# EAGLE design ESP01M_Carrier (EAGLE 9.0.1)
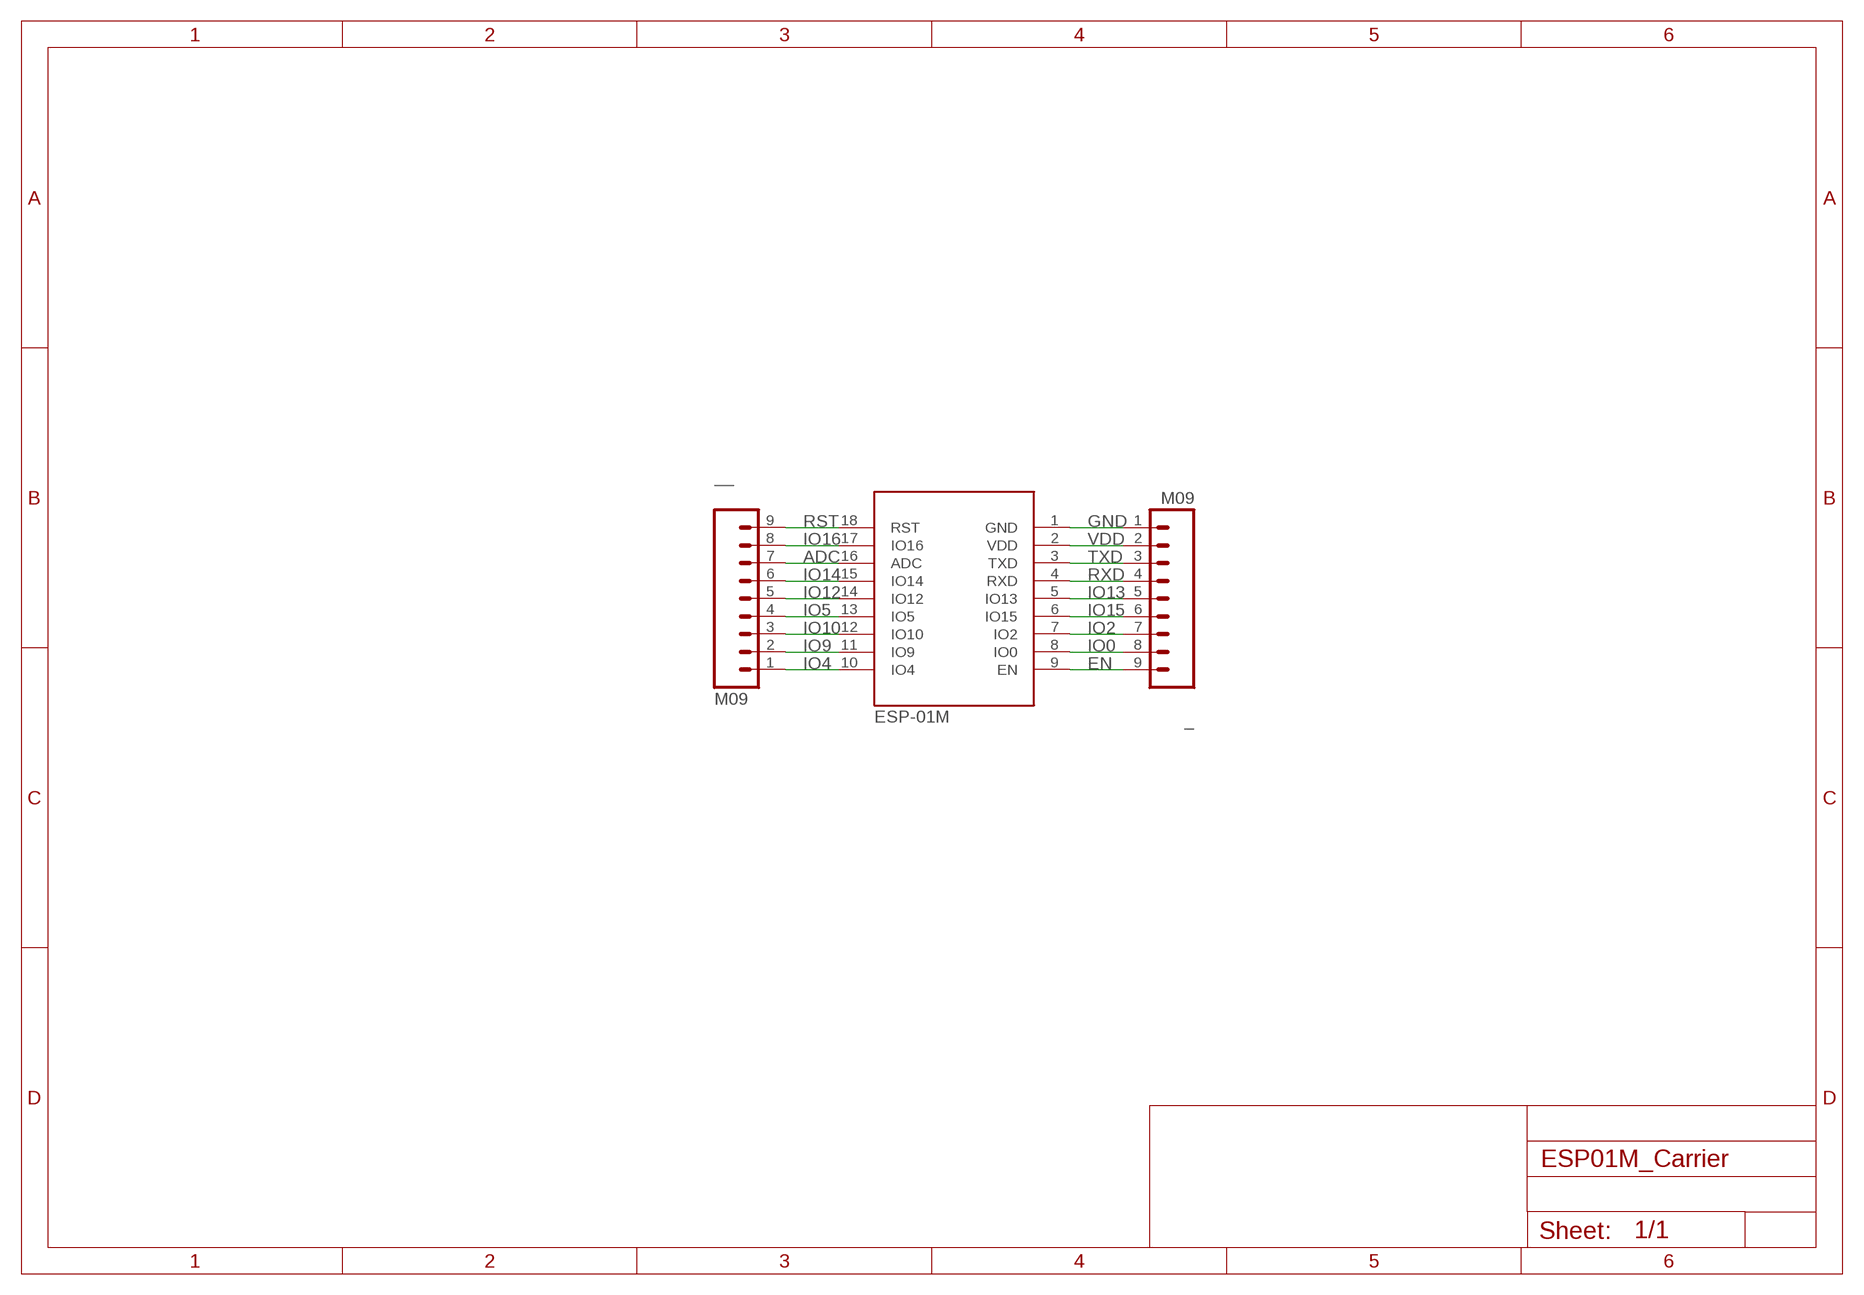
[diagram p0: schematic, sheet 1]

## Parts
_  M09  [1X09]
__  M09  [1X09]
ESP-01M  ESP-01M  [ESP-01M]

## Nets
ADC: __.7 ESP-01M.16(ADC)
EN: _.9 ESP-01M.9(EN)
GND: _.1 ESP-01M.1(GND)
IO0: _.8 ESP-01M.8(IO0)
IO2: _.7 ESP-01M.7(IO2)
IO4: __.1 ESP-01M.10(IO4)
IO5: __.4 ESP-01M.13(IO5)
IO9: __.2 ESP-01M.11(IO9)
IO10: __.3 ESP-01M.12(IO10)
IO12: __.5 ESP-01M.14(IO12)
IO13: _.5 ESP-01M.5(IO13)
IO14: __.6 ESP-01M.15(IO14)
IO15: _.6 ESP-01M.6(IO15)
IO16: __.8 ESP-01M.17(IO16)
RST: __.9 ESP-01M.18(RST)
RXD: _.4 ESP-01M.4(RXD)
TXD: _.3 ESP-01M.3(TXD)
VDD: _.2 ESP-01M.2(VDD)

## Library data of the parts
_ __ = SparkFun:M09: Header 9 Standard 9-pin 0.1" header. Use with straight break away headers (SKU : PRT-00116), right angle break away headers (PRT-00553), swiss pins (PRT-00743), machine pins (PRT-00117), and female headers (PRT-00115).
ESP-01M = Smart_Rak:ESP-01M: ESP-01M

## Board
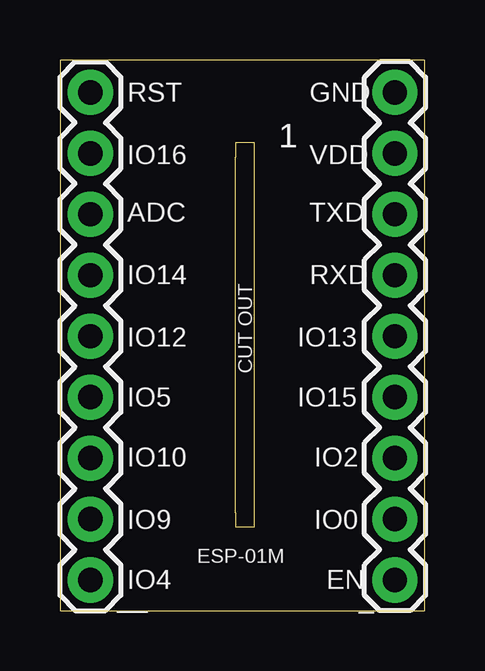
[diagram p1: board, top side]
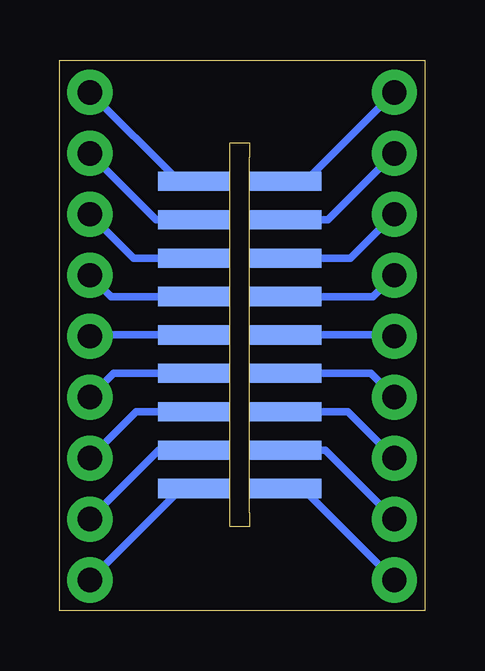
[diagram p2: board, bottom side, seen from below]

Size 15.22 x 22.94 mm. Coordinates in mm from the lower left corner, seen from the top.
Outline: 0,0 15.22,0 15.22,22.94 0,22.94 0,0
Copper layers (1*16): Top 0.035mm / dielectric 1.5mm / Bottom 0.035mm
Design rules "default": minimum track width 10mil, minimum drill 24mil, track to track 8mil, track to pad 8mil, pad to pad 8mil, via to via 8mil, smd to smd 8mil, copper to edge 40mil, drill to drill 8mil, minimum pad ring 10mil, minimum via ring 8mil, stop-mask expansion 4mil, vias tented up to drill 0mil, thermal gap 10mil

### Footprints (pad centres in the part's own frame; a part is rotated, then mirrored left to right if it is on the bottom)
1X09 = drill 1.016 pad 1.88: 1 0,0; 2 2.54,0; 3 5.08,0; 4 7.62,0; 5 10.16,0; 6 12.7,0; 7 15.24,0; 8 17.78,0; 9 20.32,0
ESP-01M = smd 3 x 0.8 bottom: 1 2,13.8; 2 2,12.2; 3 2,10.6; 4 2,9; 5 2,7.4; 6 2,5.8; 7 2,4.2; 8 2,2.6; 9 2,1; 10 -1.8,1; 11 -1.8,2.6; 12 -1.8,4.2; 13 -1.8,5.8; 14 -1.8,7.4; 15 -1.8,9; 16 -1.8,10.6; 17 -1.8,12.2; 18 -1.8,13.8

### Placement (x,y rotation side)
_  13.97,21.59 270 top
__  1.27,1.27 90 top
ESP-01M  7.62,4.08 0 top

### Tracks (layer width: path | path; a pad name or v marks a point on that pad's centre or on a via)
ADC
  Bottom 0.305: ESP-01M.16 3.1,14.68 __.7
EN
  Bottom 0.305: ESP-01M.9 10.16,5.08 _.9
GND
  Bottom 0.305: ESP-01M.1 10.26,17.88 _.1
IO0
  Bottom 0.305: ESP-01M.8 11.1,6.68 _.8
IO2
  Bottom 0.305: ESP-01M.7 12.04,8.28 _.7
IO4
  Bottom 0.305: ESP-01M.10 5.08,5.08 __.1
IO5
  Bottom 0.305: ESP-01M.13 2.26,9.88 __.4
IO9
  Bottom 0.305: ESP-01M.11 4.14,6.68 __.2
IO10
  Bottom 0.305: ESP-01M.12 3.2,8.28 __.3
IO12
  Bottom 0.305: ESP-01M.14 1.32,11.48 __.5
IO13
  Bottom 0.305: ESP-01M.5 13.92,11.48 _.5
IO14
  Bottom 0.305: ESP-01M.15 2.16,13.08 __.6
IO15
  Bottom 0.305: ESP-01M.6 12.98,9.88 _.6
IO16
  Bottom 0.305: ESP-01M.17 4.04,16.28 __.8
RST
  Bottom 0.305: ESP-01M.18 4.98,17.88 __.9
RXD
  Bottom 0.305: ESP-01M.4 13.08,13.08 _.4
TXD
  Bottom 0.305: ESP-01M.3 12.14,14.68 _.3
VDD
  Bottom 0.305: ESP-01M.2 11.2,16.28 _.2

### Text on the board
tNames: RST | GND | IO16 | VDD | ADC | TXD | IO14 | RXD | IO12 | IO13 | IO5 | IO15 | IO10 | IO2 | IO9 | IO0 | IO4 | EN